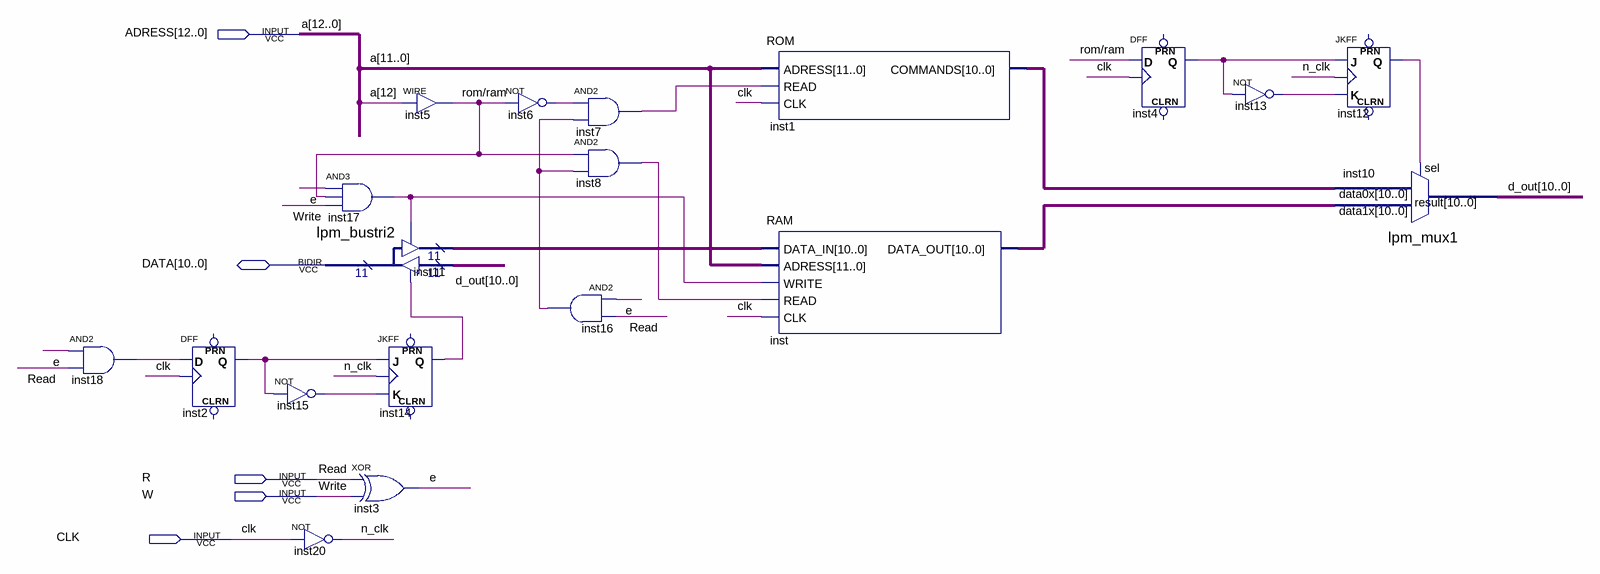
[diagram p0: schematic sheet]
// Quartus schematic MEMORY.bdf as structural Verilog: 19 symbols, 5 pins
module MEMORY (
  input  [12:0] ADRESS,
  input  R,
  input  W,
  input  CLK,
  inout  [10:0] DATA
);

  wire e, inst2_q, inst4_q, inst6_out, inst7_out, inst8_out, inst12_q, inst13_out, inst14_q, inst15_out,
       inst16_out, inst17_out, inst18_out, n_clk, \rom/ram ;
  wire [10:0] d_out, inst1_commands, inst11_result, inst_data_out;

  and inst18 (inst18_out, e, R);
  DFF inst2 (.CLK(CLK), .D(inst18_out), .Q(inst2_q));  // open: CLRN, PRN
  not inst15 (inst15_out, inst2_q);
  not inst20 (n_clk, CLK);
  and inst17 (inst17_out, e, \rom/ram , W);
  lpm_bustri2 inst11 (.enabledt(inst14_q), .data(d_out), .enabletr(inst17_out), .result(inst11_result), .tridata(DATA));
  JKFF inst14 (.K(inst15_out), .J(inst2_q), .CLK(n_clk), .Q(inst14_q));  // open: PRN, CLRN
  xor inst3 (e, R, W);
  assign \rom/ram  = ADRESS[12];  // WIRE inst5
  not inst6 (inst6_out, \rom/ram );
  and inst7 (inst7_out, inst6_out, inst16_out);
  and inst8 (inst8_out, \rom/ram , inst16_out);
  and inst16 (inst16_out, e, R);
  ROM inst1 (.ADRESS(ADRESS[11:0]), .READ(inst7_out), .CLK(CLK), .COMMANDS(inst1_commands));
  RAM inst (
    .DATA_IN(inst11_result), .ADRESS(ADRESS[11:0]), .WRITE(inst17_out), .READ(inst8_out), .CLK(CLK),
    .DATA_OUT(inst_data_out));
  DFF inst4 (.CLK(CLK), .D(\rom/ram ), .Q(inst4_q));  // open: CLRN, PRN
  not inst13 (inst13_out, inst4_q);
  JKFF inst12 (.K(inst13_out), .J(inst4_q), .CLK(n_clk), .Q(inst12_q));  // open: PRN, CLRN
  lpm_mux1 inst10 (.data1x(inst_data_out), .data0x(inst1_commands), .sel(inst12_q), .result(d_out));

  // Other names for the same wires on the sheet: a[12:0] = ADRESS; Read = R; Write = W
endmodule
